# Altium schematic sheet microcontroller.SchDoc
size A4; ApprovedBy: AH; CheckedBy: AH; CompanyName: AH19; DrawnBy: Ahsanu Amala; Revision: unknown; SheetNumber: 1; SheetTotal: 1; Project: Phase Angle Controller uC; E-mail: ahsanuamala0ff@gmail.com; Address_Website: artstation.com/caasperart; Company: AHA Inc; Address_Street: Mbahrowo; License: This work is licensed under a Creative Commons Attribution 4.0 International License.; VersionRevision: V0.1; Address_City: Kab.Semarang; Address_State_ZIP: 50612; Address_Country: Indonesia
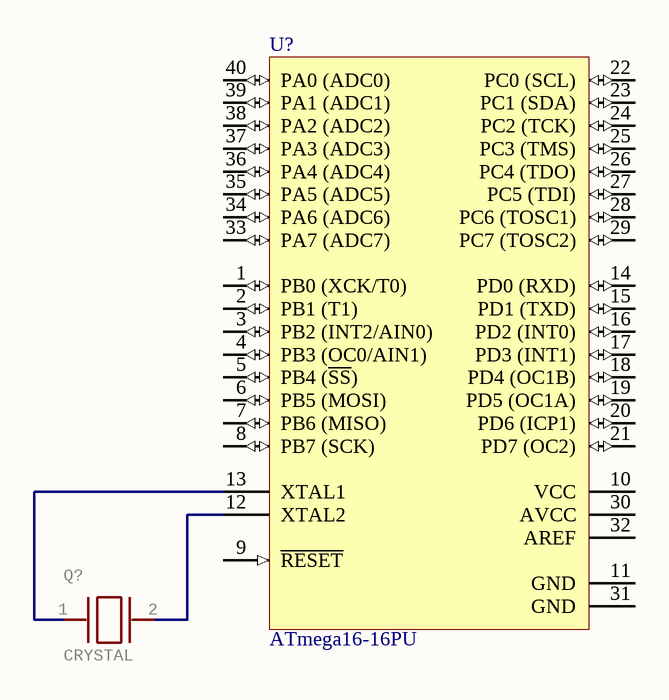
[diagram p0: microcontroller.SchDoc]

## Parts
Q?  CRYSTAL  [QS]
U?  ATmega16-16PU  [40P6]

## Nets
NetQ?_1: Q?.1 U?.13(XTAL1)
NetQ?_2: Q?.2 U?.12(XTAL2)

Not connected (* = marked no-connect by the designer): U? 1(PB0_(XCK/T0)) 2(PB1_(T1)) 3(PB2_(INT2/AIN0)) 4(PB3_(OC0/AIN1)) 5(PB4_(~{SS})) 6(PB5_(MOSI)) 7(PB6_(MISO)) 8(PB7_(SCK)) 9(~{RESET}) 10(VCC) 11(GND) 14(PD0_(RXD)) 15(PD1_(TXD)) 16(PD2_(INT0)) 17(PD3_(INT1)) 18(PD4_(OC1B)) 19(PD5_(OC1A)) 20(PD6_(ICP1)) 21(PD7_(OC2)) 22(PC0_(SCL)) 23(PC1_(SDA)) 24(PC2_(TCK)) 25(PC3_(TMS)) 26(PC4_(TDO)) 27(PC5_(TDI)) 28(PC6_(TOSC1)) 29(PC7_(TOSC2)) 30(AVCC) 31(GND) 32(AREF) 33(PA7_(ADC7)) 34(PA6_(ADC6)) 35(PA5_(ADC5)) 36(PA4_(ADC4)) 37(PA3_(ADC3)) 38(PA2_(ADC2)) 39(PA1_(ADC1)) 40(PA0_(ADC0))

## Notes on the sheet
- Title:
- Drawn By:
- Page Contents:
- Checked By:
- Size:
- Date:
- File:
- License:
- Email:
- A4
- Number:
- Time:
- Revision:
- Sheet
- Website:
- of

## Library data of the parts
Q? = XTAL/S: GateName_1: G$1; SymbolName_1: XTAL; POPULARITY: 59; LibraryName: special; DeviceSetName: XTAL/S; Package: QS
U? = ATmega16-16PU: 8-bit AVR Microcontroller, 4.5-5.5V, 16KB Flash, 512 Bytes EEPROM, 1KB SRAM, 40-pin PDIP, Industrial Grade (-40°C to 85°C), Pb-Free; DatasheetVersion: revS, May-2009; PackageVersion: revB, Sep-2001; PackageReference: 40P6; PackageDescription: 40-lead (0.600"/15.24mm Wide) Plastic Dual Inline Package (PDIP); Code_JEDEC: MS-011-AC; ComponentLink1Description: Manufacturer URL; ComponentLink1URL: http://www.atmel.com/; ComponentLink2Description: ATmega16(L)  Datasheet; ComponentLink2URL: http://www.atmel.com/dyn/resources/prod_documents/doc2466.pdf; ComponentLink3Description: ATmega16(L) Summary; ComponentLink3URL: http://www.atmel.com/dyn/resources/prod_documents/2466S.pdf